# EAGLE design sod323-breakout (EAGLE 5.10)
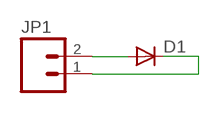
[diagram p0: schematic, sheet 1]

## Parts
D1  DIODESOD  [SOD-323]
JP1  M02LOCK_LONGPADS  [1X02_LOCK_LONGPADS]

## Nets
ANODE: D1.2(A) JP1.2
CATHODE: D1.1(C) JP1.1

## Library data of the parts
D1 = SparkFun:DIODE: Diode These are standard reverse protection diodes and small signal diodes. SMA package can handle up to about 1A. SOD-323 can handle about 200mA. What the SOD-323 package when ordering, there are some mfgs out there that are 5-pin packages.
JP1 = SparkFun:M02: Header 2 Standard 2-pin 0.1" header. Use with straight break away headers (SKU : PRT-00116), right angle break away headers (PRT-00553), swiss pins (PRT-00743), machine pins (PRT-00117), and female headers (PRT-00115). Molex polarized connector foot print use with SKU : PRT-08233 with associated crimp pins and housings.

## Board
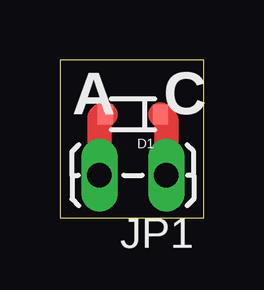
[diagram p1: board, top side]

Size 6.02 x 6.59 mm. Coordinates in mm from the lower left corner, seen from the top.
Outline: 0,0 6.02,0 6.02,6.59 0,6.59 0,0
Copper layers (1*16): Top 0.035mm / dielectric 1.5mm / Bottom 0.035mm
Design rules "default": minimum track width 10mil, minimum drill 24mil, track to track 8mil, track to pad 8mil, pad to pad 8mil, via to via 8mil, smd to smd 8mil, copper to edge 40mil, drill to drill 8mil, minimum pad ring 10mil, minimum via ring 8mil, stop-mask expansion 4mil, vias tented up to drill 0mil, thermal gap 10mil

### Footprints (pad centres in the part's own frame; a part is rotated, then mirrored left to right if it is on the bottom)
SOD-323 = smd 0.63 x 0.83: 1 -1.15,0; 2 1.15,0
1X02_LOCK_LONGPADS = drill 1.016 long: 1 -0.127,0; 2 2.667,0

### Placement (x,y rotation side)
D1  3.05,4.32 180 top
JP1  4.32,1.78 180 top

### Tracks (layer width: path | path; a pad name or v marks a point on that pad's centre or on a via)
ANODE
  Top 1.016: JP1.2 1.65,4.19 1.78,4.32 D1.2
CATHODE
  Top 1.016: JP1.1 4.45,4.07 D1.1

### Text on the board
tPlace: A | C